# EAGLE design STM32L4_Lora (EAGLE 9.6.2)

## Sheet 1 of 2
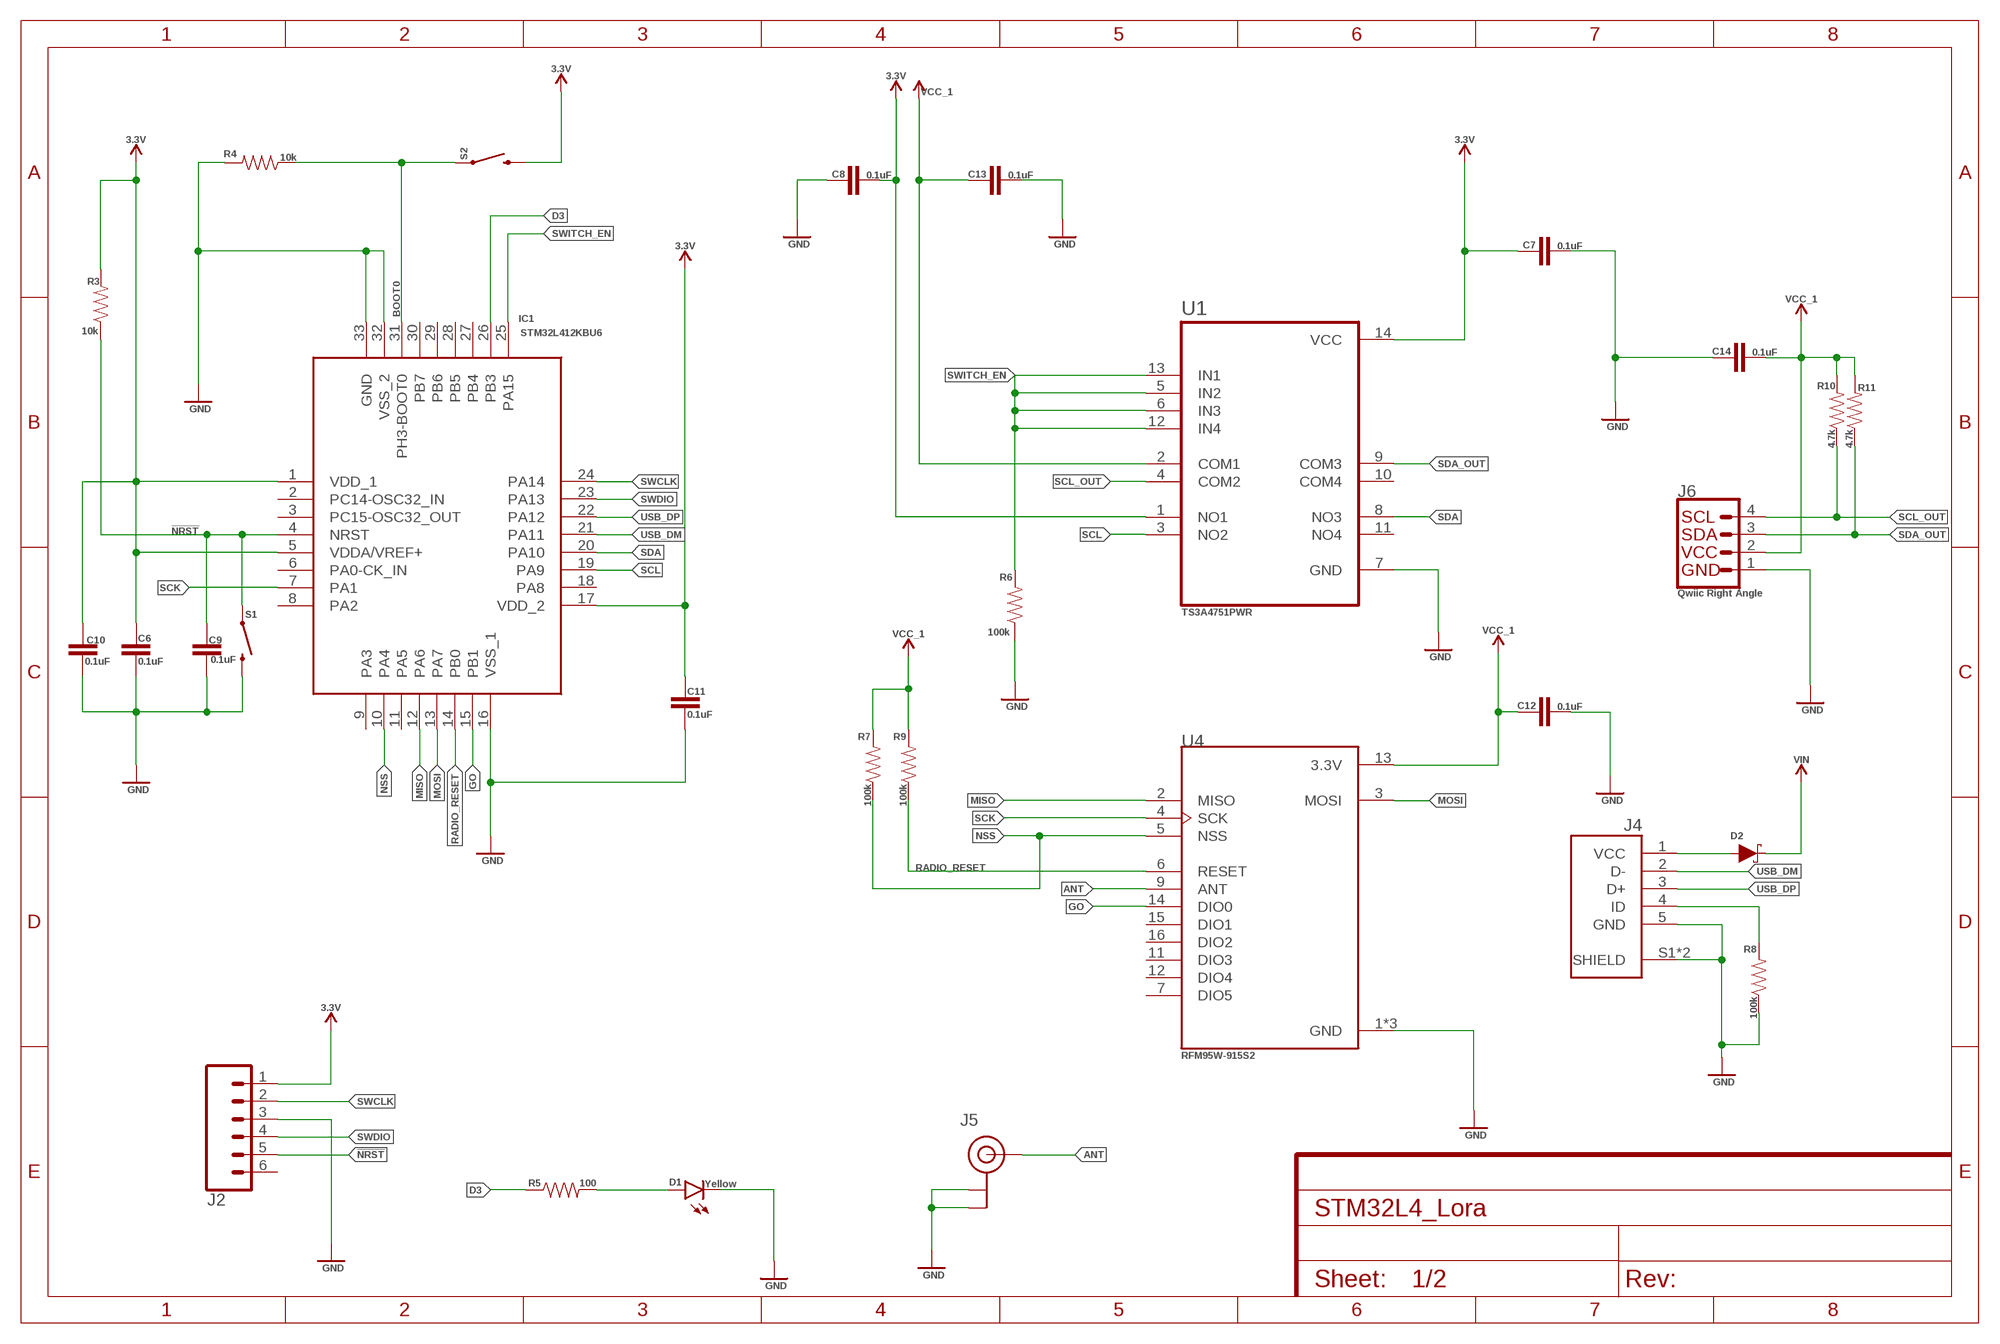
[diagram p0: schematic, sheet 1]

### Parts
C6  0.1uF  0.1UF-0603-25V-(+80/-20%)  [0603]
C7  0.1uF  0.1UF-0603-25V-(+80/-20%)  [0603]
C8  0.1uF  0.1UF-0603-25V-(+80/-20%)  [0603]
C9  0.1uF  0.1UF-0603-25V-(+80/-20%)  [0603]
C10  0.1uF  0.1UF-0603-25V-(+80/-20%)  [0603]
C11  0.1uF  0.1UF-0603-25V-(+80/-20%)  [0603]
C12  0.1uF  0.1UF-0603-25V-(+80/-20%)  [0603]
C13  0.1uF  0.1UF-0603-25V-(+80/-20%)  [0603]
C14  0.1uF  0.1UF-0603-25V-(+80/-20%)  [0603]
D1  Yellow  LED-YELLOW0603  [LED-0603]
D2  120mA/40V/370mV  DIODE-SCHOTTKY-RB751S40  [SOD-523]
IC1  STM32L412KBU6  [QFN50P500X500X60-33N]
J2  CONN_06LOCK_LONGPADS  [1X06_LOCK_LONGPADS]
J4  USB3131-30-0230-A_REVB  [GCT_USB3131-30-0230-A_REVB]
J5  U.FL  [U.FL]
J6  Qwiic Right Angle  I2C_STANDARDQWIIC  [1X04_1MM_RA]
R3  10k  10KOHM-0603-1/10W-1%  [0603]
R4  10k  10KOHM-0603-1/10W-1%  [0603]
R5  100  100OHM-0603-1/4W-5%  [0603]
R6  100k  100KOHM-0603-1/10W-1%  [0603]
R7  100k  100KOHM-0603-1/10W-1%  [0603]
R8  100k  100KOHM-0603-1/10W-1%  [0603]
R9  100k  100KOHM-0603-1/10W-1%  [0603]
R10  4.7k  4.7KOHM-0603-1/10W-1%  [0603]
R11  4.7k  4.7KOHM-0603-1/10W-1%  [0603]
S1  MOMENTARY-SWITCH-SPST-SMD-4.6X2.8MM  [TACTILE_SWITCH_SMD_4.6X2.8MM]
S2  MOMENTARY-SWITCH-SPST-SMD-4.6X2.8MM  [TACTILE_SWITCH_SMD_4.6X2.8MM]
U1  TS3A4751PWR  [SOP65P640X120-14N]
U4  RFM95W-915S2  [XCVR_RFM95W-915S2]

### Nets
3.3V: C6.1 C7.1 C8.2 C10.1 C11.1 IC1.1(VDD_1) IC1.5(VDDA/VREF+) IC1.17(VDD_2) J2.1 R3.2 S2.3 S2.4 U1.1(NO1) U1.14(VCC) ; also sheet 2
!NRST: C9.1 IC1.4(NRST) J2.5 R3.1 S1.1 S1.2
ANT: J5.FEED(SIGNAL) U4.9(ANT)
BOOT0: IC1.31(PH3-BOOT0) R4.1 S2.1 S2.2
D3: IC1.26(PB3) R5.1
GND: C6.2 C7.2 C8.1 C9.2 C10.2 C11.2 C12.2 C13.2 C14.1 D1.C IC1.16(VSS_1) IC1.32(VSS_2) IC1.33(GND) J2.3 J4.5(GND) J4.S1(SHIELD) J4.S2(SHIELD) J5.1(GND) J5.2(GND) J6.1 R4.2 R6.1 R8.1 S1.3 S1.4 U1.7(GND) U4.1(GND) U4.8(GND) U4.10(GND) ; also sheet 2
GO: IC1.15(PB1) U4.14(DIO0)
MISO: IC1.12(PA6) U4.2(MISO)
MOSI: IC1.13(PA7) U4.3(MOSI)
N$6: D1.A R5.2
N$7: J4.4(ID) R8.2
N$8: D2.A J4.1(VCC)
NSS: IC1.10(PA4) R7.1 U4.5(NSS)
RADIO_RESET: IC1.14(PB0) R9.1 U4.6(RESET)
SCK: IC1.7(PA1) U4.4(SCK)
SCL: IC1.19(PA9) U1.3(NO2)
SCL_OUT: J6.4 R10.1 U1.4(COM2)
SDA: IC1.20(PA10) U1.8(NO3)
SDA_OUT: J6.3 R11.1 U1.9(COM3)
SWCLK: IC1.24(PA14) J2.2
SWDIO: IC1.23(PA13) J2.4
SWITCH_EN: IC1.25(PA15) R6.2 U1.5(IN2) U1.6(IN3) U1.12(IN4) U1.13(IN1)
USB_DM: IC1.21(PA11) J4.2(D-)
USB_DP: IC1.22(PA12) J4.3(D+)
VCC_1: C12.1 C13.1 C14.2 J6.2 R7.2 R9.2 R10.2 R11.2 U1.2(COM1) U4.13(3.3V)
VIN: D2.C ; also sheet 2
Unconnected: IC1.2(PC14-OSC32_IN) IC1.3(PC15-OSC32_OUT) IC1.6(PA0-CK_IN) IC1.8(PA2) IC1.9(PA3) IC1.11(PA5) IC1.18(PA8) IC1.27(PB4) IC1.28(PB5) IC1.29(PB6) IC1.30(PB7) J2.6 U1.10(COM4) U1.11(NO4) U4.7(DIO5) U4.11(DIO3) U4.12(DIO4) U4.15(DIO1) U4.16(DIO2)

## Sheet 2 of 2
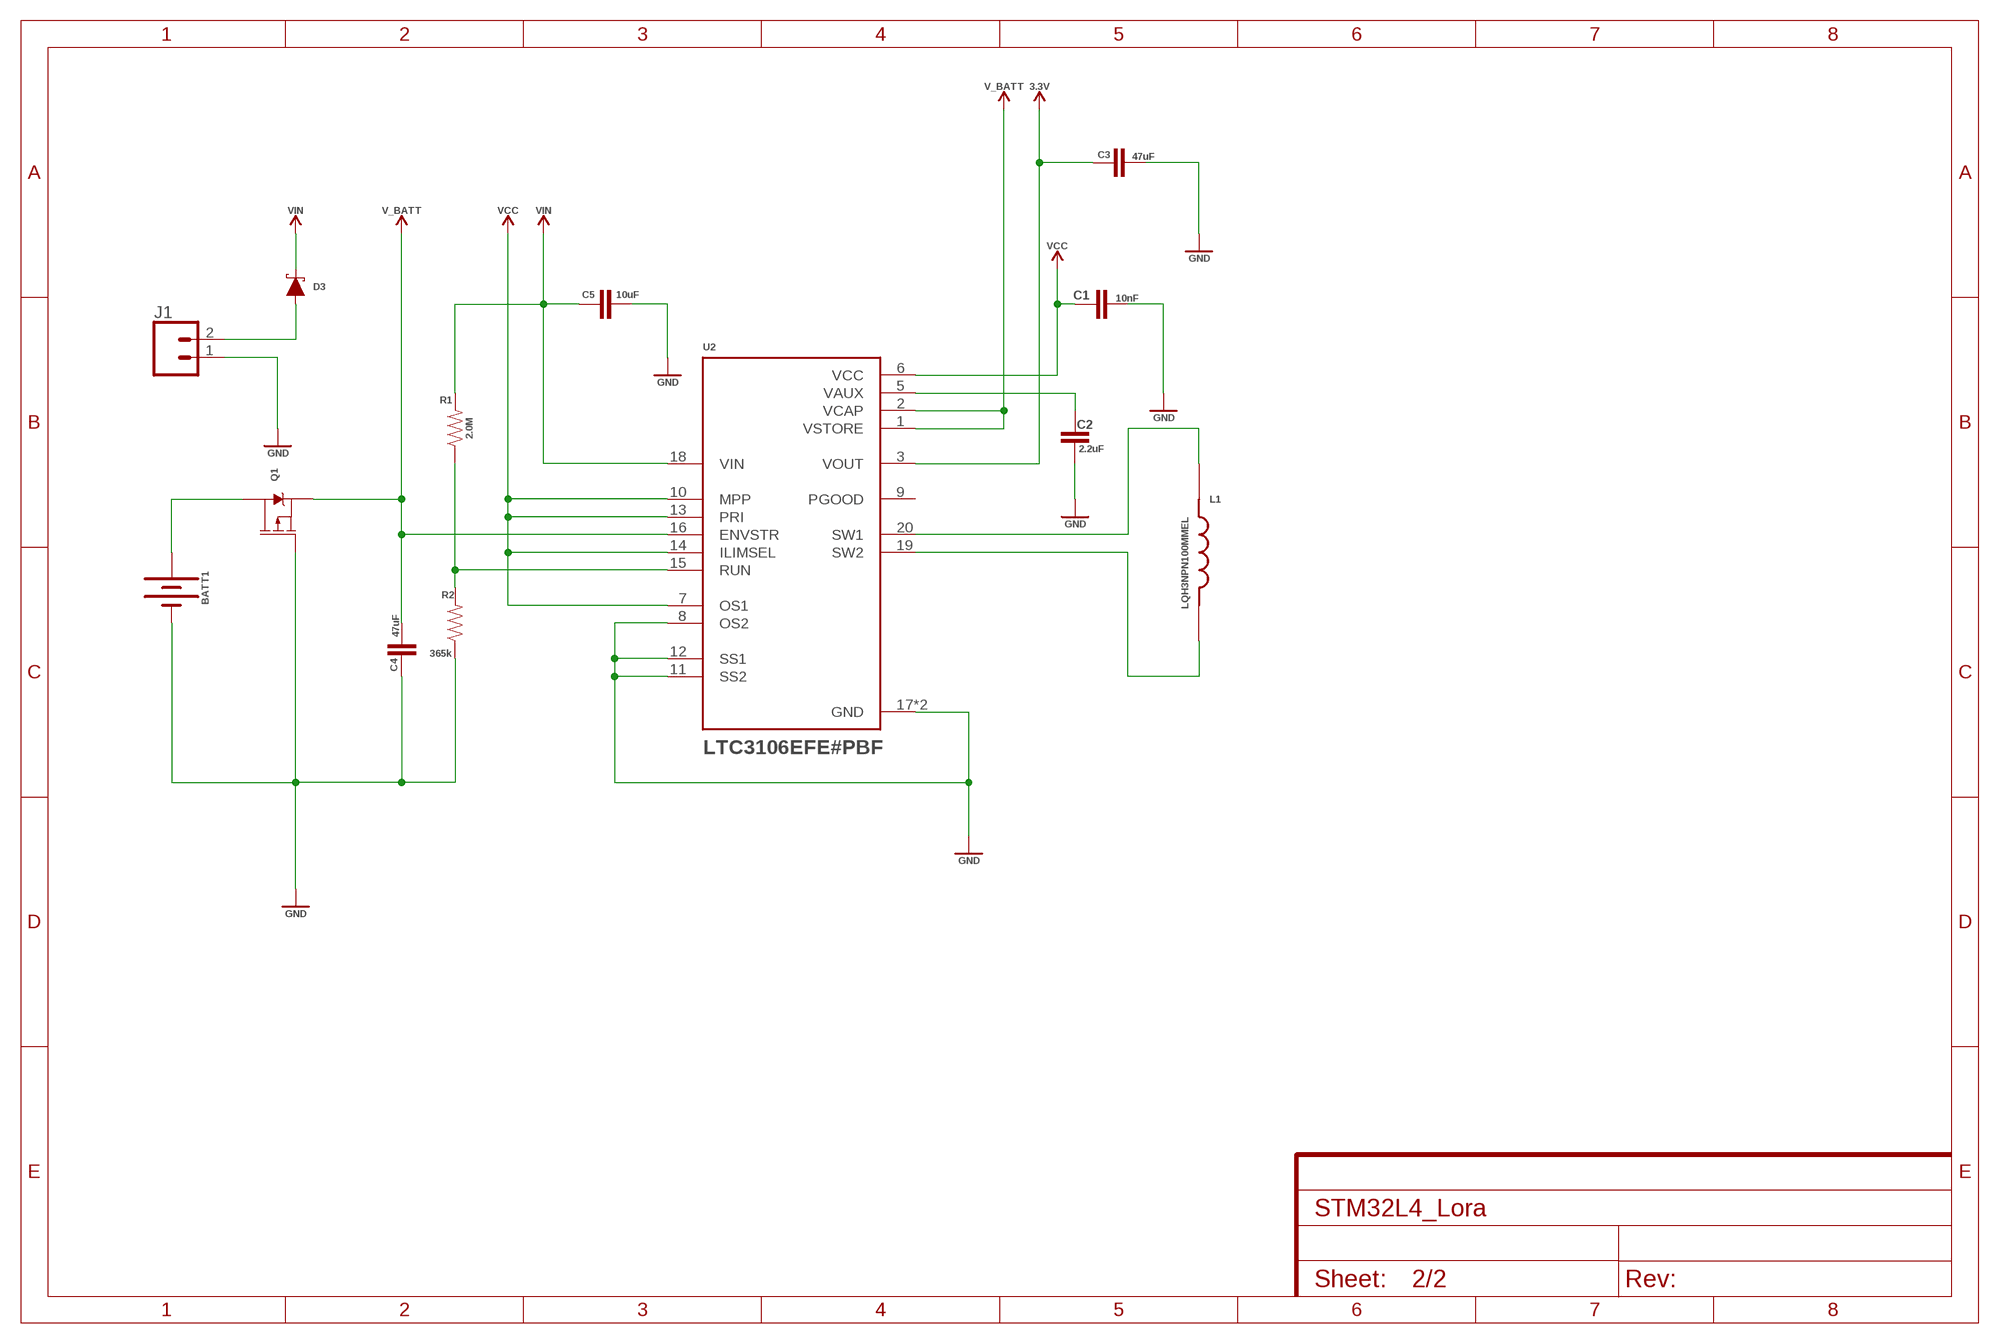
[diagram p1: schematic, sheet 2]

### Parts
BATT1  KEYSTONE_54KEYSTONE_2  [KEYSTONE_V2]
C1  10nF  10NF-0603-50V-10%  [0603]
C2  2.2uF  2.2UF-0603-10V-20%  [0603]
C3  47uF  4.7UF0603  [0603]
C4  47uF  4.7UF0603  [0603]
C5  10uF  10UF-0603-6.3V-20%  [0603]
D3  120mA/40V/370mV  DIODE-SCHOTTKY-RB751S40  [SOD-523]
J1  CONN_023.5MM  [SCREWTERMINAL-3.5MM-2]
L1  LQH3NPN100MMEL  [IND_LQH3NPN100MMEL]
Q1  2.5A/30V/105mΩ  MOSFET_PCH-DMG2307L  [SOT23-3]
R1  2.0M  2MOHMS-0603-1/10W-1%  [0603]
R2  365k  390KOHM-0603-1/10W-1%  [0603]
U2  LTC3106EFE#PBF  [SOP65P640X120-21N]

### Nets
3.3V: C3.1 U2.3(VOUT) ; also sheet 1
GND: BATT1.P$4(-) BATT1.P$5(-) BATT1.P$6(-) C1.2 C2.2 C3.2 C4.1 C5.2 J1.1 Q1.1(G) R2.1 U2.8(OS2) U2.11(SS2) U2.12(SS1) U2.17(GND) U2.21(GND) ; also sheet 1
N$1: L1.1 U2.20(SW1)
N$2: L1.2 U2.19(SW2)
N$3: C2.1 U2.5(VAUX)
N$4: BATT1.P$1(+) BATT1.P$2(+) BATT1.P$3(+) Q1.3(D)
N$5: R1.1 R2.2 U2.15(RUN)
N$9: D3.A J1.2
V_BATT: C4.2 Q1.2(S) U2.1(VSTORE) U2.2(VCAP) U2.16(ENVSTR)
VCC: C1.1 U2.6(VCC) U2.7(OS1) U2.10(MPP) U2.13(PRI) U2.14(ILIMSEL)
VIN: C5.1 D3.C R1.2 U2.18(VIN) ; also sheet 1
Unconnected: U2.9(PGOOD)

## Library data of the parts
BATT1 = battery_54:KEYSTONE_54
C1 = SparkFun-Capacitors:10NF: 0.01uF/10nF/10,000pF ceramic capacitors A capacitor is a passive two-terminal electrical component used to store electrical energy temporarily in an electric field. CAP-09321; PROD_ID: CAP-00867
C2 = SparkFun-Capacitors:2.2UF: 2.2µF ceramic capacitors A capacitor is a passive two-terminal electrical component used to store electrical energy temporarily in an electric field.; PROD_ID: CAP-07888
C3 C4 = SparkFun-Capacitors:4.7UF: 4.7µF ceramic capacitors A capacitor is a passive two-terminal electrical component used to store electrical energy temporarily in an electric field.; PROD_ID: CAP-08280; VALUE: 4.7uF
C5 = SparkFun-Capacitors:10UF: 10.0µF ceramic capacitors A capacitor is a passive two-terminal electrical component used to store electrical energy temporarily in an electric field.; PROD_ID: CAP-11015
C6-C14 = SparkFun-Capacitors:0.1UF: 0.1µF ceramic capacitors A capacitor is a passive two-terminal electrical component used to store electrical energy temporarily in an electric field.; PROD_ID: CAP-00810
D1 = SparkFun-LED:LED-YELLOW: Yellow SMD LED Used in manufacturing several products at SparkFun. Packages: 0603 - SMD 0603 package[Product Link] <http://www.kingbrightusa.com/product.asp?catalog_name=LED&product_id=APT1608SYCK> 0603 -SMART - SMART SMD 0603 package (more efficient/more expensive) [Product Link] <http://www.osram-os.com/osram_os/en/products/product-catalog/led-light-emitting-diodes/smartled-0603/ly-l29k/index.jsp> LilyPad - SMD1206 package[Product Datasheet] <https://www.sparkfun.com/datasheets/DevTools/LilyPad/Q150YUS4.pdf> SparkFun Products: Blynk Board <https://www.sparkfun.com/products/13794> IOIO-OTG <https://www.sparkfun.com/products/13613> XBee Explorer Serial <https://www.sparkfun.com/products/13225>; PROD_ID: DIO-09003
D2 D3 = SparkFun-DiscreteSemi:DIODE-SCHOTTKY: Schottky diode A Schottky diode is a semiconductor diode which has a low forward voltage drop and a very fast switching action.; PROD_ID: DIO-11018
IC1 = SamacSys_Parts:STM32L412KBU6: STMICROELECTRONICS - STM32L412KBU6 - MCU, 32BIT, 80MHZ, QFN-32 Source: Datasheet <https://www.st.com/resource/en/datasheet/stm32l412kb.pdf>; ARROW_PART_NUMBER: STM32L412KBU6; ARROW_PRICE-STOCK: https://www.arrow.com/en/products/stm32l412kbu6/stmicroelectronics; DESCRIPTION: STMICROELECTRONICS - STM32L412KBU6 - MCU, 32BIT, 80MHZ, QFN-32; HEIGHT: 0.6mm; MANUFACTURER_NAME: STMicroelectronics; MANUFACTURER_PART_NUMBER: STM32L412KBU6; MOUSER_PART_NUMBER: 511-STM32L412KBU6; MOUSER_PRICE-STOCK: https://www.mouser.co.uk/ProductDetail/STMicroelectronics/STM32L412KBU6?qs=%252BEew9%252B0nqrBbLYx2P7jokA%3D%3D
J1 = SparkFun-Connectors:CONN_02: Multi connection point. Often used as Generic Header-pin footprint for 0.1 inch spaced/style header connections On any of the 0.1 inch spaced packages, you can populate with these: Break Away Headers - Straight <https://www.sparkfun.com/products/116> (PRT-00116) Break Away Male Headers - Right Angle <https://www.sparkfun.com/products/553> (PRT-00553) Female Headers <https://www.sparkfun.com/products/115> (PRT-00115) Break Away Headers - Machine Pin <https://www.sparkfun.com/products/117> (PRT-00117) Break Away Female Headers - Swiss Machine Pin <https://www.sparkfun.com/products/743> (PRT-00743) For SCREWTERMINALS and SPRING TERMINALS visit here: Screw Terimnals on SparkFun.com <https://www.sparkfun.com/search/results?term=Screw+Terminals> (5mm/3.5mm/2.54mm spacing) This device is also useful as a general connection point to wire up your design to another part of your project. Our various solder wires solder well into these plated through hole pads. Hook-Up Wire - Assortment (Stranded, 22 AWG) <https://www.sparkfun.com/products/11375> (PRT-11375) Hook-Up Wire - Assortment (Solid Core, 22 AWG) <https://www.sparkfun.com/products/11367> (PRT-11367) View the entire wire category on our website here <https://www.sparkfun.com/categories/141> Special notes: Molex polarized connector foot print use with: PRT-08233 with associated crimp pins and housings. 2.54_SCREWTERM for use with PRT-10571. 3.5mm Screw Terminal footprints for PRT-08084 5mm Screw Terminal footprints for use with PRT-08432; PROD_ID: CONN-08399
J2 = SparkFun-Connectors:CONN_06: Multi connection point. Often used as Generic Header-pin footprint for 0.1 inch spaced/style header connections On any of the 0.1 inch spaced packages, you can populate with these: Break Away Headers - Straight <https://www.sparkfun.com/products/116> (PRT-00116) Break Away Male Headers - Right Angle <https://www.sparkfun.com/products/553> (PRT-00553) Female Headers <https://www.sparkfun.com/products/115> (PRT-00115) Break Away Headers - Machine Pin <https://www.sparkfun.com/products/117> (PRT-00117) Break Away Female Headers - Swiss Machine Pin <https://www.sparkfun.com/products/743> (PRT-00743) Arduino Stackable Header - 6 Pin <https://www.sparkfun.com/products/9280> (PRT-09280) For SCREWTERMINALS and SPRING TERMINALS visit here: Screw Terimnals on SparkFun.com <https://www.sparkfun.com/search/results?term=Screw+Terminals> (5mm/3.5mm/2.54mm spacing) This device is also useful as a general connection point to wire up your design to another part of your project. Our various solder wires solder well into these plated through hole pads. Hook-Up Wire - Assortment (Stranded, 22 AWG) <https://www.sparkfun.com/products/11375> (PRT-11375) Hook-Up Wire - Assortment (Solid Core, 22 AWG) <https://www.sparkfun.com/products/11367> (PRT-11367) View the entire wire category on our website here <https://www.sparkfun.com/categories/141>
J4 = USB3131-30-0230-A_REVB:USB3131-30-0230-A_REVB: USB - micro B USB 2.0 Receptacle Connector 5 Position Through Hole; AVAILABILITY: Unavailable; DESCRIPTION: USB - micro B USB 2.0 Receptacle Connector 5 Position Through Hole; MF: Global Connector Technology; MP: USB3131-30-0230-A; PACKAGE: None; PRICE: None
J5 = SparkFun-Connectors:U.FL: SMD Antenna Connector - U.FL 2mm height, 3.0mm x 3.0mm receptacle size. SparkFun Products: SparkFun WiFi Shield - ESP8266 <https://www.sparkfun.com/products/13287> SparkFun ESP8266 Thing <https://www.sparkfun.com/products/13231> SparkFun MiniGen - Pro Mini Signal Generator Shield <https://www.sparkfun.com/products/11420>; PROD_ID: CONN-09193; SF_ID: WRL-09144
J6 = SparkFun-Connectors:I2C_STANDARD: SparkFun I2C Standard Pinout Header SparkFun has standardized on a pinout for all I2C based sensor breakouts. This pinout allows I2C boards to be plugged directly into the headers on Arduino Uno compatible boards, and to be daisy chained easily. Example SparkFun Products: SparkFun Atmospheric Sensor Breakout - BME280 <https://www.sparkfun.com/products/13676> SparkFun Altitude/Pressure Sensor Breakout - MPL3115A2 <https://www.sparkfun.com/products/11084> SparkFun TOF Range Finder Sensor - VL6180 <https://www.sparkfun.com/products/12785>; PROD_ID: CONN-13694
L1 = LQH3NPN100MMEL:LQH3NPN100MMEL: Fixed Inductors; DESCRIPTION: 10µH Shielded Wirewound Inductor 800mA 228mOhm Max 1212 (3030 Metric); DIGI-KEY_PART_NUMBER: 490-15945-1-ND; DIGIKEY-PURCHASE-URL: https://snapeda.com/shop?store=DigiKey&id=4547508; MF: Murata; MOUSER-PURCHASE-URL: https://snapeda.com/shop?store=Mouser&id=4547508; MP: LQH3NPN100MMEL; PACKAGE: 1212 Murata
Q1 = SparkFun-DiscreteSemi:MOSFET_PCH: P-channel MOSFETs Voltage controlled devices that allow control of high current outputs. SparkFun Products: SparkFun ESP32 Thing <https://www.sparkfun.com/products/13907> SparkFun ESP8266 Thing <https://www.sparkfun.com/products/13231>; PROD_ID: TRANS-11308
R1 = SparkFun-Resistors:2MOHMS: 2MΩ resistor A resistor is a passive two-terminal electrical component that implements electrical resistance as a circuit element. Resistors act to reduce current flow, and, at the same time, act to lower voltage levels within circuits. - Wikipedia; PROD_ID: RES-10054
R2 = SparkFun-Resistors:390KOHM: 390kΩ resistor A resistor is a passive two-terminal electrical component that implements electrical resistance as a circuit element. Resistors act to reduce current flow, and, at the same time, act to lower voltage levels within circuits. - Wikipedia; PROD_ID: RES-12024; VALUE: 390k
R3 R4 = SparkFun-Resistors:10KOHM: 10kΩ resistor A resistor is a passive two-terminal electrical component that implements electrical resistance as a circuit element. Resistors act to reduce current flow, and, at the same time, act to lower voltage levels within circuits. - Wikipedia; PROD_ID: RES-00824
R5 = SparkFun-Resistors:100OHM: 100Ω resistor A resistor is a passive two-terminal electrical component that implements electrical resistance as a circuit element. Resistors act to reduce current flow, and, at the same time, act to lower voltage levels within circuits. - Wikipedia; PROD_ID: RES-12438
R6-R9 = SparkFun-Resistors:100KOHM: 100kΩ resistor A resistor is a passive two-terminal electrical component that implements electrical resistance as a circuit element. Resistors act to reduce current flow, and, at the same time, act to lower voltage levels within circuits. - Wikipedia; PROD_ID: RES-07828
R10 R11 = SparkFun-Resistors:4.7KOHM: 4.7kΩ resistor A resistor is a passive two-terminal electrical component that implements electrical resistance as a circuit element. Resistors act to reduce current flow, and, at the same time, act to lower voltage levels within circuits. - Wikipedia; PROD_ID: RES-07857
S1 S2 = SparkFun-Switches:MOMENTARY-SWITCH-SPST: Momentary Switch (Pushbutton) - SPST Normally-open (NO) SPST momentary switches (buttons, pushbuttons). Variants PTH-12MM - 12mm square, through-hole Momentary Pushbutton Switch - 12mm Square <https://www.sparkfun.com/products/9190> (COM-09190) PTH-6.0MM, PTH-6.0MM-KIT - 6.0mm square, through-hole Mini Pushbutton Switch <https://www.sparkfun.com/products/97> (COM-00097) KIT package intended for soldering kit's - only one side of pads' copper is exposed. PTH-RIGHT-ANGLE-KIT - Right-angle, through-hole Right Angle Tactile Button <https://www.sparkfun.com/products/10791> - Used on SparkFun BigTime Watch Kit <https://www.sparkfun.com/products/11734> SMD-12MM - 12mm square, surface-mount Tactile Button - SMD (12mm) <https://www.sparkfun.com/products/12993> (COM-12993) Used on SparkFun PicoBoard <https://www.sparkfun.com/products/11888> SMD-4.5MM - 4.5mm Square Trackball Switch Used on SparkFun Blackberry Trackballer Breakout <https://www.sparkfun.com/products/13169> SMD-4.6MMX2.8MM - 4.60mm x 2.80mm, surface mount Used on SparkFun SAMD21 Mini Breakout <https://www.sparkfun.com/products/13664> SMD-5.2MM, SMD-5.2-REDUNDANT - 5.2mm square, surface-mount Mini Pushbutton Switch - SMD <https://www.sparkfun.com/products/8720> (COM-08720) Used on Arduino Pro Mini <https://www.sparkfun.com/products/11114> REDUNDANT package connects both switch circuits together SMD-6.0X3.5MM - 6.0 x 3.5mm, surface mount Momentary Reset Switch SMD <https://www.sparkfun.com/products/8229> (COM-08229) SMD-6.2MM-TALL - 6.2mm square, surface mount Tactile Button - SMD (6mm) <https://www.sparkfun.com/products/12992> Used on SparkFun Digital Sandbox <https://www.sparkfun.com/products/12651> SMD-RIGHT-ANGLE - Right-angle, surface mount Used on SparkFun Block for Intel® Edison - Arduino <https://www.sparkfun.com/products/13036>; PROD_ID: SWCH-13065
U1 = TS3A4751PWR:TS3A4751PWR; ARROW_ELECTRONICS-PURCHASE-URL: https://snapeda.com/shop?store=Arrow+Electronics&id=361966; DESCRIPTION: 0.9-?, 3.3-V, 1:1 (SPST), 4-channel analog switch with 1.8-V input logic 14-TSSOP -40 to 85; DIGI-KEY_PART_NUMBER: 296-20700-1-ND; DIGIKEY-PURCHASE-URL: https://snapeda.com/shop?store=DigiKey&id=361966; MF: Texas Instruments; MOUSER-PURCHASE-URL: https://snapeda.com/shop?store=Mouser&id=361966; MP: TS3A4751PWR; PACKAGE: TSSOP-14 Texas Instruments; TEXAS_INSTRUMENTS-PURCHASE-URL: https://snapeda.com/shop?store=Texas+Instruments&id=361966
U2 = LTC3106EFE_PBF:LTC3106EFE#PBF: LTC3106 - 300mA Low Voltage Buck-Boost Converter with PowerPath and 1.6μA Quiescent Current; DESCRIPTION: Conv DC-DC -0.3V to 6V Non-Inv/Inv/Step Up/Step Down Single-Out 1.8V/2.2V/3.3V/5V 0.3A 20-Pin TSSOP; MF: Analog Devices; MOUSER-PURCHASE-URL: https://snapeda.com/shop?store=Mouser&id=4332360; MP: LTC3106EFE#PBF; PACKAGE: TSSOP W/ EP-20 Analog Devices
U4 = RFM95W-915S2:RFM95W-915S2: RFM95(W) - Low Power Long Range Transceiver Module V1.0 Buy Part <https://snapeda.com/parts/RFM95W-915S2/RF%20Solutions/view-part/?ref=eda>; AVAILABILITY: Bad; DESCRIPTION: General ISM < 1GHz LoRa™ Transceiver Module 915MHz Surface Mount; MF: RF Solutions; MOUSER-PURCHASE-URL: https://snapeda.com/shop?store=Mouser&id=585488; MP: RFM95W-915S2; PACKAGE: SMD-16 RF Solutions; PRICE: None

## Board
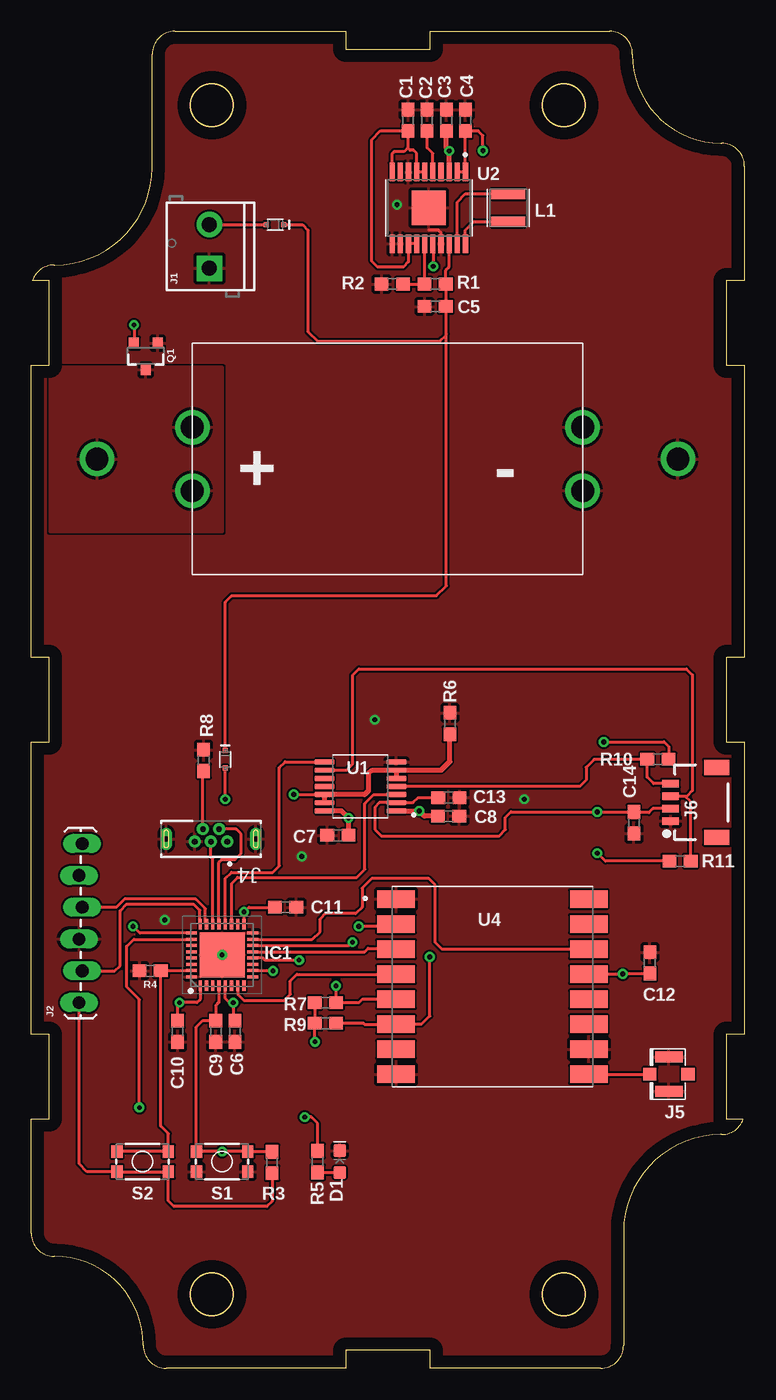
[diagram p2: board, top side]
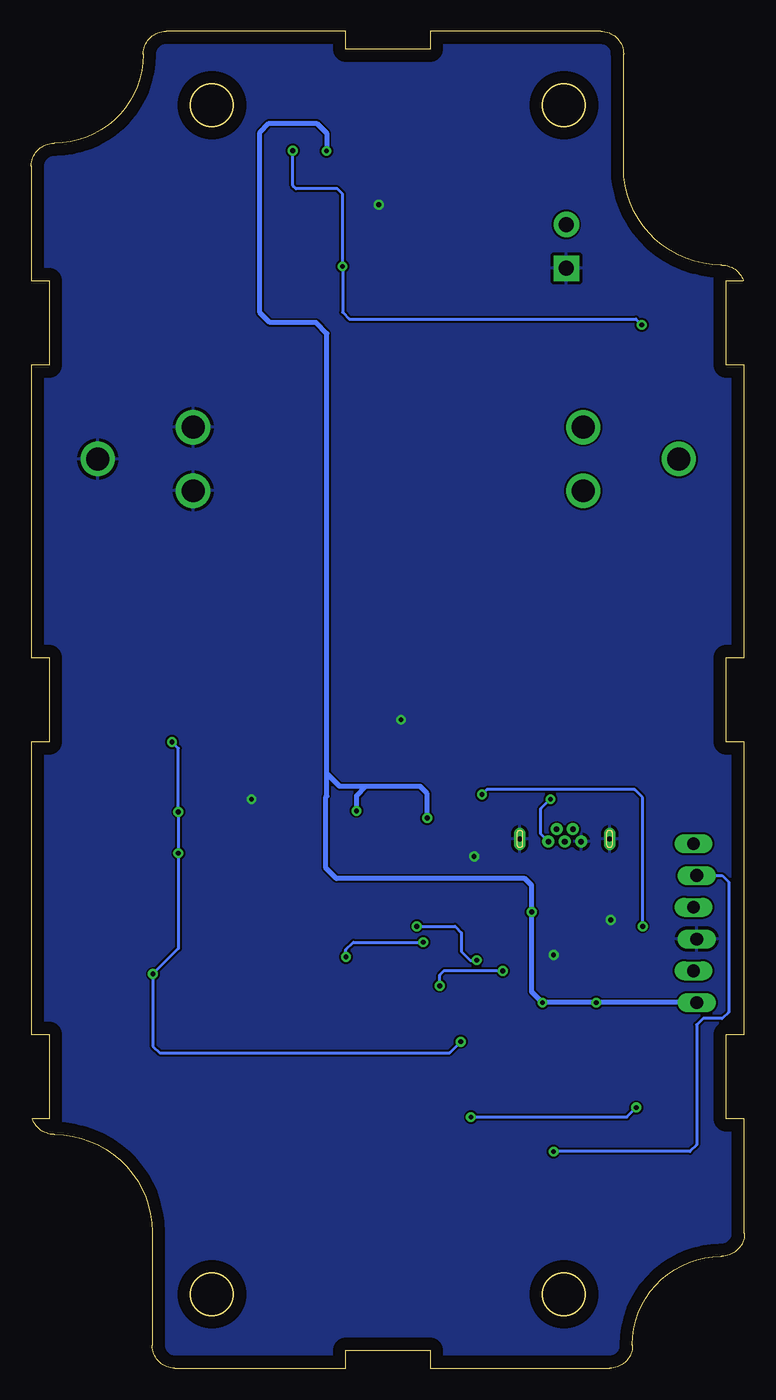
[diagram p3: board, bottom side, seen from below]

Size 56.96 x 106.82 mm. Coordinates in mm from the lower left corner, seen from the top.
Outline: 55.09,97.88 55.14,97.88 arc-90 56.96,96.06 56.96,86.88 55.51,86.88 55.51,80.13 56.96,80.13 56.96,56.78 55.51,56.78 55.51,50.03 56.96,50.03 56.96,26.68 55.51,26.68 55.51,19.93 56.87,19.93 arc-72 55.14,18.67 55.09,18.67 arc90 47.3,10.89 47.3,1.82 arc-90 45.48,0 31.85,0 31.85,1.44 25.1,1.44 25.1,0 10.76,0 arc-90 8.94,1.82 8.94,1.87 arc90 1.87,8.94 1.82,8.94 arc-90 0,10.76 0,19.93 1.44,19.93 1.44,26.68 0,26.68 0,50.03 1.44,50.03 1.44,56.78 0,56.78 0,80.13 1.44,80.13 1.44,86.88 0.09,86.88 arc-72 1.82,88.15 1.87,88.15 arc90 9.65,95.93 9.65,105 arc-90 11.47,106.82 25.1,106.82 25.1,105.37 31.85,105.37 31.85,106.82 46.2,106.82 arc-90 48.02,105 48.02,104.94 arc90 55.09,97.88
Outline: circle at 14.42,100.91 radius 1.71
Outline: circle at 42.54,100.91 radius 1.71
Outline: circle at 42.54,5.91 radius 1.71
Outline: circle at 14.42,5.91 radius 1.71
Copper layers (1*16): Top 0.035mm / dielectric 1.5mm / Bottom 0.035mm
Design rules "default": minimum track width 6mil, minimum drill 0.35mm, track to track 6mil, track to pad 6mil, pad to pad 6mil, via to via 6mil, smd to smd 6mil, copper to edge 40mil, drill to drill 6mil, minimum pad ring 10mil, minimum via ring 8mil, stop-mask expansion 4mil, vias tented up to drill 0mil, thermal gap 10mil

### Footprints (pad centres in the part's own frame; a part is rotated, then mirrored left to right if it is on the bottom)
KEYSTONE_V2 = drill 1.829: P$1 15.58,2.54; P$2 15.58,-2.54; P$3 23.2,0; P$4 -15.58,2.54; P$5 -15.58,-2.54; P$6 -23.2,0
0603 = smd 1.1 x 1: 1 -0.85,0; 2 0.85,0
LED-0603 = smd 1 x 1: A -0.877,0; C 0.877,0
SOD-523 = smd 0.4 x 0.4: A -0.7,0; C 0.7,0
QFN50P500X500X60-33N = smd 0.85 x 0.25: 1 -2.45,1.75; 2 -2.45,1.25; 3 -2.45,0.75; 4 -2.45,0.25; 5 -2.45,-0.25; 6 -2.45,-0.75; 7 -2.45,-1.25; 8 -2.45,-1.75; 17 2.45,-1.75; 18 2.45,-1.25; 19 2.45,-0.75; 20 2.45,-0.25; 21 2.45,0.25; 22 2.45,0.75; 23 2.45,1.25; 24 2.45,1.75 | smd 0.25 x 0.85: 9 -1.75,-2.45; 10 -1.25,-2.45; 11 -0.75,-2.45; 12 -0.25,-2.45; 13 0.25,-2.45; 14 0.75,-2.45; 15 1.25,-2.45; 16 1.75,-2.45; 25 1.75,2.45; 26 1.25,2.45; 27 0.75,2.45; 28 0.25,2.45; 29 -0.25,2.45; 30 -0.75,2.45; 31 -1.25,2.45; 32 -1.75,2.45 | smd 3.6 x 3.6: 33 0,0
SCREWTERMINAL-3.5MM-2 = drill 1.2 pad 2.032 square: 1 0,0 | drill 1.2 pad 2.032: 2 3.5,0
1X06_LOCK_LONGPADS = drill 1.016 long: 1 0,0; 2 2.54,-0.254; 3 5.08,0; 4 7.62,-0.254; 5 10.16,0; 6 12.7,-0.254
GCT_USB3131-30-0230-A_REVB = drill 0.45: 1 -1.3,0.22; 2 -0.65,-0.78; 3 0,0.22; 4 0.65,-0.78; 5 1.3,0.22 | drill 0.4 long: S1 -3.575,0; S2 3.575,0
U.FL = smd 2.2 x 0.85: 1 0,1.375; 2 0,-1.375 | smd 1.05 x 1: FEED 1.525,0; NC -1.525,0
1X04_1MM_RA = smd 0.6 x 1.35: 1 -1.5,0; 2 -0.5,0; 3 0.5,0; 4 1.5,0 | smd 1.2 x 2: NC1 2.8,-3.675; NC2 -2.8,-3.675
IND_LQH3NPN100MMEL = smd 0.8 x 2.7: 1 -1.1,0; 2 1.1,0
SOT23-3 = smd 0.8 x 0.9: 1 -0.95,-1; 2 0.95,-1; 3 0,1.1
TACTILE_SWITCH_SMD_4.6X2.8MM = smd 0.9 x 1: 1 -2.05,-0.8; 2 2.05,-0.8; 3 2.05,0.8; 4 -2.05,0.8
SOP65P640X120-14N = smd 1.57 x 0.41: 1 -2.87,1.95; 2 -2.87,1.3; 3 -2.87,0.65; 4 -2.87,0; 5 -2.87,-0.65; 6 -2.87,-1.3; 7 -2.87,-1.95; 8 2.87,-1.95; 9 2.87,-1.3; 10 2.87,-0.65; 11 2.87,0; 12 2.87,0.65; 13 2.87,1.3; 14 2.87,1.95
SOP65P640X120-21N = smd 1.48 x 0.41: 1 -2.865,2.925; 2 -2.865,2.275; 3 -2.865,1.625; 4 -2.865,0.975; 5 -2.865,0.325; 6 -2.865,-0.325; 7 -2.865,-0.975; 8 -2.865,-1.625; 9 -2.865,-2.275; 10 -2.865,-2.925; 11 2.865,-2.925; 12 2.865,-2.275; 13 2.865,-1.625; 14 2.865,-0.975; 15 2.865,-0.325; 16 2.865,0.325; 17 2.865,0.975; 18 2.865,1.625; 19 2.865,2.275; 20 2.865,2.925 | smd 2.74 x 2.74: 21 0,0
XCVR_RFM95W-915S2 = smd 3 x 1.4: 1 -7.7,7; 2 -7.7,5; 3 -7.7,3; 4 -7.7,1; 5 -7.7,-1; 6 -7.7,-3; 7 -7.7,-5; 8 -7.7,-7; 9 7.7,-7; 10 7.7,-5; 11 7.7,-3; 12 7.7,-1; 13 7.7,1; 14 7.7,3; 15 7.7,5; 16 7.7,7

### Placement (x,y rotation side)
BATT1  28.45,72.64 180 top
C1  30.1,99.69 90 top
C2  31.62,99.69 90 top
C3  33.15,99.69 90 top
C4  34.67,99.69 270 top
C5  32.26,84.84 180 top
C6  16.26,26.92 270 top
C7  24.49,42.57 180 top
C8  33.32,44.12 180 top
C9  14.73,26.92 270 top
C10  11.68,26.92 270 top
C11  20.32,36.83 0 top
C12  49.4,32.38 90 top
C13  33.35,45.59 0 top
C14  48.13,43.59 90 top
D1  24.64,16.51 90 top
D2  15.49,48.64 90 top
D3  19.48,91.36 0 top
IC1  15.24,33.02 90 top
J1  14.22,87.88 90 top
J2  3.81,29.21 90 top
J4  14.35,42.29 180 top
J5  50.93,23.5 180 top
J6  51.05,45.21 90 top
L1  38.1,92.71 90 top
Q1  9.14,80.9 180 top
R1  32.26,86.61 0 top
R2  28.83,86.61 0 top
R3  19.23,16.43 270 top
R4  9.5,31.75 180 top
R5  22.86,16.51 270 top
R6  33.43,51.51 270 top
R7  23.5,29.21 180 top
R8  13.77,48.56 270 top
R9  23.5,27.56 180 top
R10  50.04,48.64 0 top
R11  51.82,40.51 180 top
S1  15.24,16.51 180 top
S2  8.89,16.51 180 top
U1  26.29,46.48 180 top
U2  31.75,92.71 270 top
U4  36.83,30.48 0 top

### Tracks (layer width: path | path; a pad name or v marks a point on that pad's centre or on a via)
3.3V  (via drill 0.38)
  Top 0.254: IC1.17 v16.99,36.45 17.37,36.83 C11.1 | C10.1 11.68,29.06 v11.84,29.21 13.23,29.21 13.49,29.47 IC1.1 | J2.1 3.81,16.33 4.43,15.71 S2.3 S2.4 10.94,13.37 11.38,12.93 18.82,12.93 19.23,13.34 R3.2 | C6.1 16.15,27.88 16.15,29.01 15.93,29.23 | 15.93,29.23 15.8,29.23 15.49,29.54 IC1.5 | 15.93,29.23 16.1,29.23 v16.13,29.21
  Top 0.381: U2.3 v33.38,97.26 33.15,97.48 C3.1 | C7.1 v25.34,43.96 24.76,44.53 U1.14 | C8.2 31.39,44.12 v30.98,44.53 U1.1
  Bottom 0.381: 33.35,47.5 33.35,45.72 33.43,45.64 33.43,39.95 32.59,39.12 17.53,39.12 16.99,38.58 v16.99,36.45 16.99,30.07 v16.13,29.21 v11.84,29.21 J2.1 | 33.35,47.5 33.35,82.68 34.21,83.54 37.9,83.54 38.71,84.35 38.71,98.73 37.97,99.47 34.16,99.47 33.38,98.68 v33.38,97.26 | v25.34,43.96 25.34,45.91 25.91,46.48 30.23,46.48 | 33.35,47.5 32.33,46.48 30.23,46.48 | v30.98,44.53 30.98,45.73 30.23,46.48
!NRST  (via drill 0.38)
  Top 0.254: R3.1 17.32,17.28 S1.1 v15.24,17.31 S1.2 13.19,27.26 13.7,27.77 C9.1 14.73,28.96 14.99,29.21 IC1.4
  Bottom 0.254: J2.5 1.78,39.37 1.27,38.86 1.27,28.45 1.78,27.94 3.3,27.94 3.81,27.43 3.81,17.86 4.36,17.31 v15.24,17.31
ANT
  Top 0.254: U4.9 49.39,23.48 J5.FEED
BOOT0
  Top 0.254: R4.1 10.37,31.77 10.54,31.77 | 10.54,31.77 IC1.31 | S2.2 S2.1 10.94,18.75 10.34,19.36 10.34,31.57 10.54,31.77
D3  (via drill 0.38)
  Top 0.254: R5.1 22.86,19.56 22.35,20.07 v21.84,20.07 | v8.64,20.83 8.64,29.46 7.62,30.48 7.62,33.71 8.18,34.27 IC1.26
  Bottom 0.254: v21.84,20.07 9.4,20.07 v8.64,20.83
GND  (via drill 0.38)
  Top 0.254: U2.17 32.73,90.72 32.51,90.93 31.75,90.93
  other vias: 29.21,92.96 15.24,33.02 10.67,35.81 27.43,51.82 39.37,45.47 21.59,40.89
  pour Top (rank 6): -1.91,0.25 -1.91,106.93 56.39,106.93 56.39,0.25
  pour Bottom (rank 6): -1.91,0.25 -1.91,107.7 56.39,107.7 56.39,0.25
GO
  Top 0.254: U4.14 32.81,33.48 32.26,34.04 32.26,38.61 31.75,39.12 27.18,39.12 26.42,38.35 26.42,36.83 25.91,36.32 23.5,36.32 23.06,35.89 23.06,34.87 22.46,34.27 IC1.15
MISO  (via drill 0.38)
  Top 0.254: U4.2 28.96,35.31 v26.16,35.31 | v21.39,32.6 18.66,32.6 18.49,32.77 IC1.12
  Bottom 0.254: v21.39,32.6 21.9,32.6 22.61,33.3 22.61,34.8 23.11,35.31 v26.16,35.31
MOSI
  Top 0.254: IC1.13 26.61,33.27 26.9,33.55 29.06,33.55 U4.3
N$1
  Top 0.254: U2.20 34.67,90.94 35.36,91.62 L1.1
N$2
  Top 0.254: U2.19 34.02,93.18 34.67,93.83 37.41,93.83 37.62,93.62 37.91,93.62 L1.2
N$3
  Top 0.254: U2.5 32.08,97.06 31.62,97.51 C2.1
N$4
  pour Top: 8.89,80.01 15.24,80.01 15.24,77.22 15.24,66.8 14.22,66.8 1.52,66.8 1.52,80.01
N$5
  Top 0.254: R2.2 R1.1 31.43,86.63 U2.15
N$6
  Top 0.254: R5.2 24.61,15.66 D1.A
N$7
  Top 0.152: 13.7,47.65 R8.2
  Top 0.254: J4.4 13.7,47.65
N$8  (via drill 0.38)
  Top 0.254: v15.49,45.47 D2.A
  Bottom 0.254: J4.1 16.25,42.67 16.26,42.67 16.26,44.7 v15.49,45.47
N$9
  Top 0.254: J1.2 18.78,91.38 D3.A
NSS  (via drill 0.38)
  Top 0.254: U4.5 26.47,29.49 26.19,29.21 R7.1 24.34,30.54 v24.33,30.56 | IC1.10 19.28,31.77 v19.3,31.75
  Bottom 0.254: v24.33,30.56 24.33,31.42 23.98,31.77 19.33,31.77 v19.3,31.75
RADIO_RESET  (via drill 0.38)
  Top 0.254: R9.1 26.52,27.56 26.6,27.48 U4.6 31.16,27.48 31.83,28.14 v31.83,32.87 | IC1.14 25.39,33.77 v25.65,34.04
  Bottom 0.254: v25.65,34.04 31.24,34.04 31.83,33.45 v31.83,32.87
SCK
  Top 0.254: IC1.7 16.49,29.86 16.97,29.39 20.22,29.39 20.7,29.87 20.7,30.96 21.22,31.48 U4.4
SCL
  Top 0.254: IC1.19 15.99,38.72 16.48,39.22 26.01,39.22 26.64,39.85 26.64,45.11 27.37,45.83 U1.3
SCL_OUT
  Top 0.254: J6.4 49.71,46.71 49.19,47.23 R10.1 44.96,48.64 44.32,48.01 44.32,46.99 43.81,46.48 U1.4
SDA
  Top 0.254: IC1.20 15.49,39.11 16,39.62 19.3,39.62 19.81,40.13 19.81,47.98 20.27,48.44 U1.8
SDA_OUT
  Top 0.254: U1.9 25.18,47.78 25.65,48.26 25.65,55.37 26.16,55.88 52.32,55.88 52.81,55.4 52.81,46.15 52.35,45.7 52.25,45.7 | 52.25,45.7 51.07,45.7 J6.3 | R11.1 52.67,45.28 52.25,45.7
SWCLK
  Top 0.254: IC1.24 13.46,35.5 13.46,36.58 12.95,37.08 7.62,37.08 7.09,36.55 7.09,32.16 6.68,31.75 J2.2
SWDIO
  Top 0.254: IC1.23 13.9,35.56 13.9,36.72 13.12,37.49 7.45,37.49 6.79,36.83 J2.4
SWITCH_EN  (via drill 0.38)
  Top 0.254: IC1.25 8.66,34.77 v8.13,35.31 | v20.95,45.85 23.34,45.85 23.42,45.77
  Top 0.381: U1.13 23.42,45.77 U1.12 26.63,45.83 26.92,46.13 26.92,47.5 27.18,47.75 29.13,47.75 U1.6 | U1.6 U1.5 | R6.2 33.43,48.46 32.74,47.78 U1.6 | U1.6 29.21,47.73
  Bottom 0.254: v8.13,35.31 8.13,45.59 8.76,46.23 20.57,46.23 v20.95,45.85
USB_DM
  Top 0.254: IC1.21 14.99,40.39 15.24,40.64 16.26,40.64 16.76,41.15 16.76,42.67 16.36,43.08 J4.2
USB_DP
  Top 0.254: IC1.22 14.49,40.73 14.35,40.87 J4.3
V_BATT  (via drill 0.38)
  Top 0.254: U2.2 U2.1 C4.2 35.7,98.84 36.07,98.48 v36.07,97.28 | U2.16 32.1,89.82 v32.1,88.04 | v8.2,83.36 8.2,81.91 Q1.2
  Bottom 0.254: v8.2,83.36 8.66,83.82 31.55,83.82 32.1,84.37 v32.1,88.04 32.1,93.82 32.51,94.23 35.81,94.23 36.07,94.49 v36.07,97.28
VCC
  Top 0.254: U2.6 U2.7 30.77,97.06 30.53,97.31 30.25,97.31 30.1,97.46 30.1,97.54 | 30.1,97.54 30.1,98.68 | 30.1,98.68 C1.1 | 30.1,97.54 29.77,97.21 28.98,97.21 28.8,97.03 28.8,95.6 U2.10 | U2.14 U2.13 30.12,88.39 29.72,87.99 27.66,87.99 27.2,88.44 27.2,98.17 27.89,98.86 29.92,98.86 30.1,98.68
VCC_1  (via drill 0.38)
  Top 0.254: C13.1 30.89,45.59 30.48,45.18 U1.2 27.81,45.18 27.43,44.81 27.43,43.05 27.94,42.55 37.39,42.55 37.87,43.03 37.87,44.02 38.3,44.45 v45.21,44.45 48.12,44.45 C14.2 48.17,44.4 49.33,44.4 49.64,44.71 J6.2 | R7.2 R9.2 22.66,27.55 v22.66,26.09 | C12.1 47.28,31.54 v47.24,31.5 47.23,31.48 U4.13 | v45.72,50.04 50.55,50.04 50.9,49.68 50.9,48.66 R10.2 | R11.2 45.85,40.51 v45.21,41.15
  Bottom 0.254: v45.72,50.04 45.21,49.53 v45.21,44.45 v45.21,41.15 45.21,33.53 v47.24,31.5 47.24,25.73 46.71,25.2 23.55,25.2 v22.66,26.09
VIN
  Top 0.254: U2.18 33.38,87.99 33.11,87.72 R1.2 C5.1 33.12,84.82 33.12,82.65 | D3.C 21.67,91.36 22.1,90.93 22.1,82.8 22.86,82.04 32.64,82.04 33.12,82.53 33.12,82.65 | D2.C 15.49,61.21 16,61.72 32.36,61.72 33.15,62.51 33.15,82.63 33.12,82.65